# Altium schematic sheet MySTM32F103C8.SchDoc: MySTM32F103C8
size A3; DrawnBy: Pami; DocumentNumber: P010; Revision: v1.1; SheetNumber: 1; SheetTotal: 1
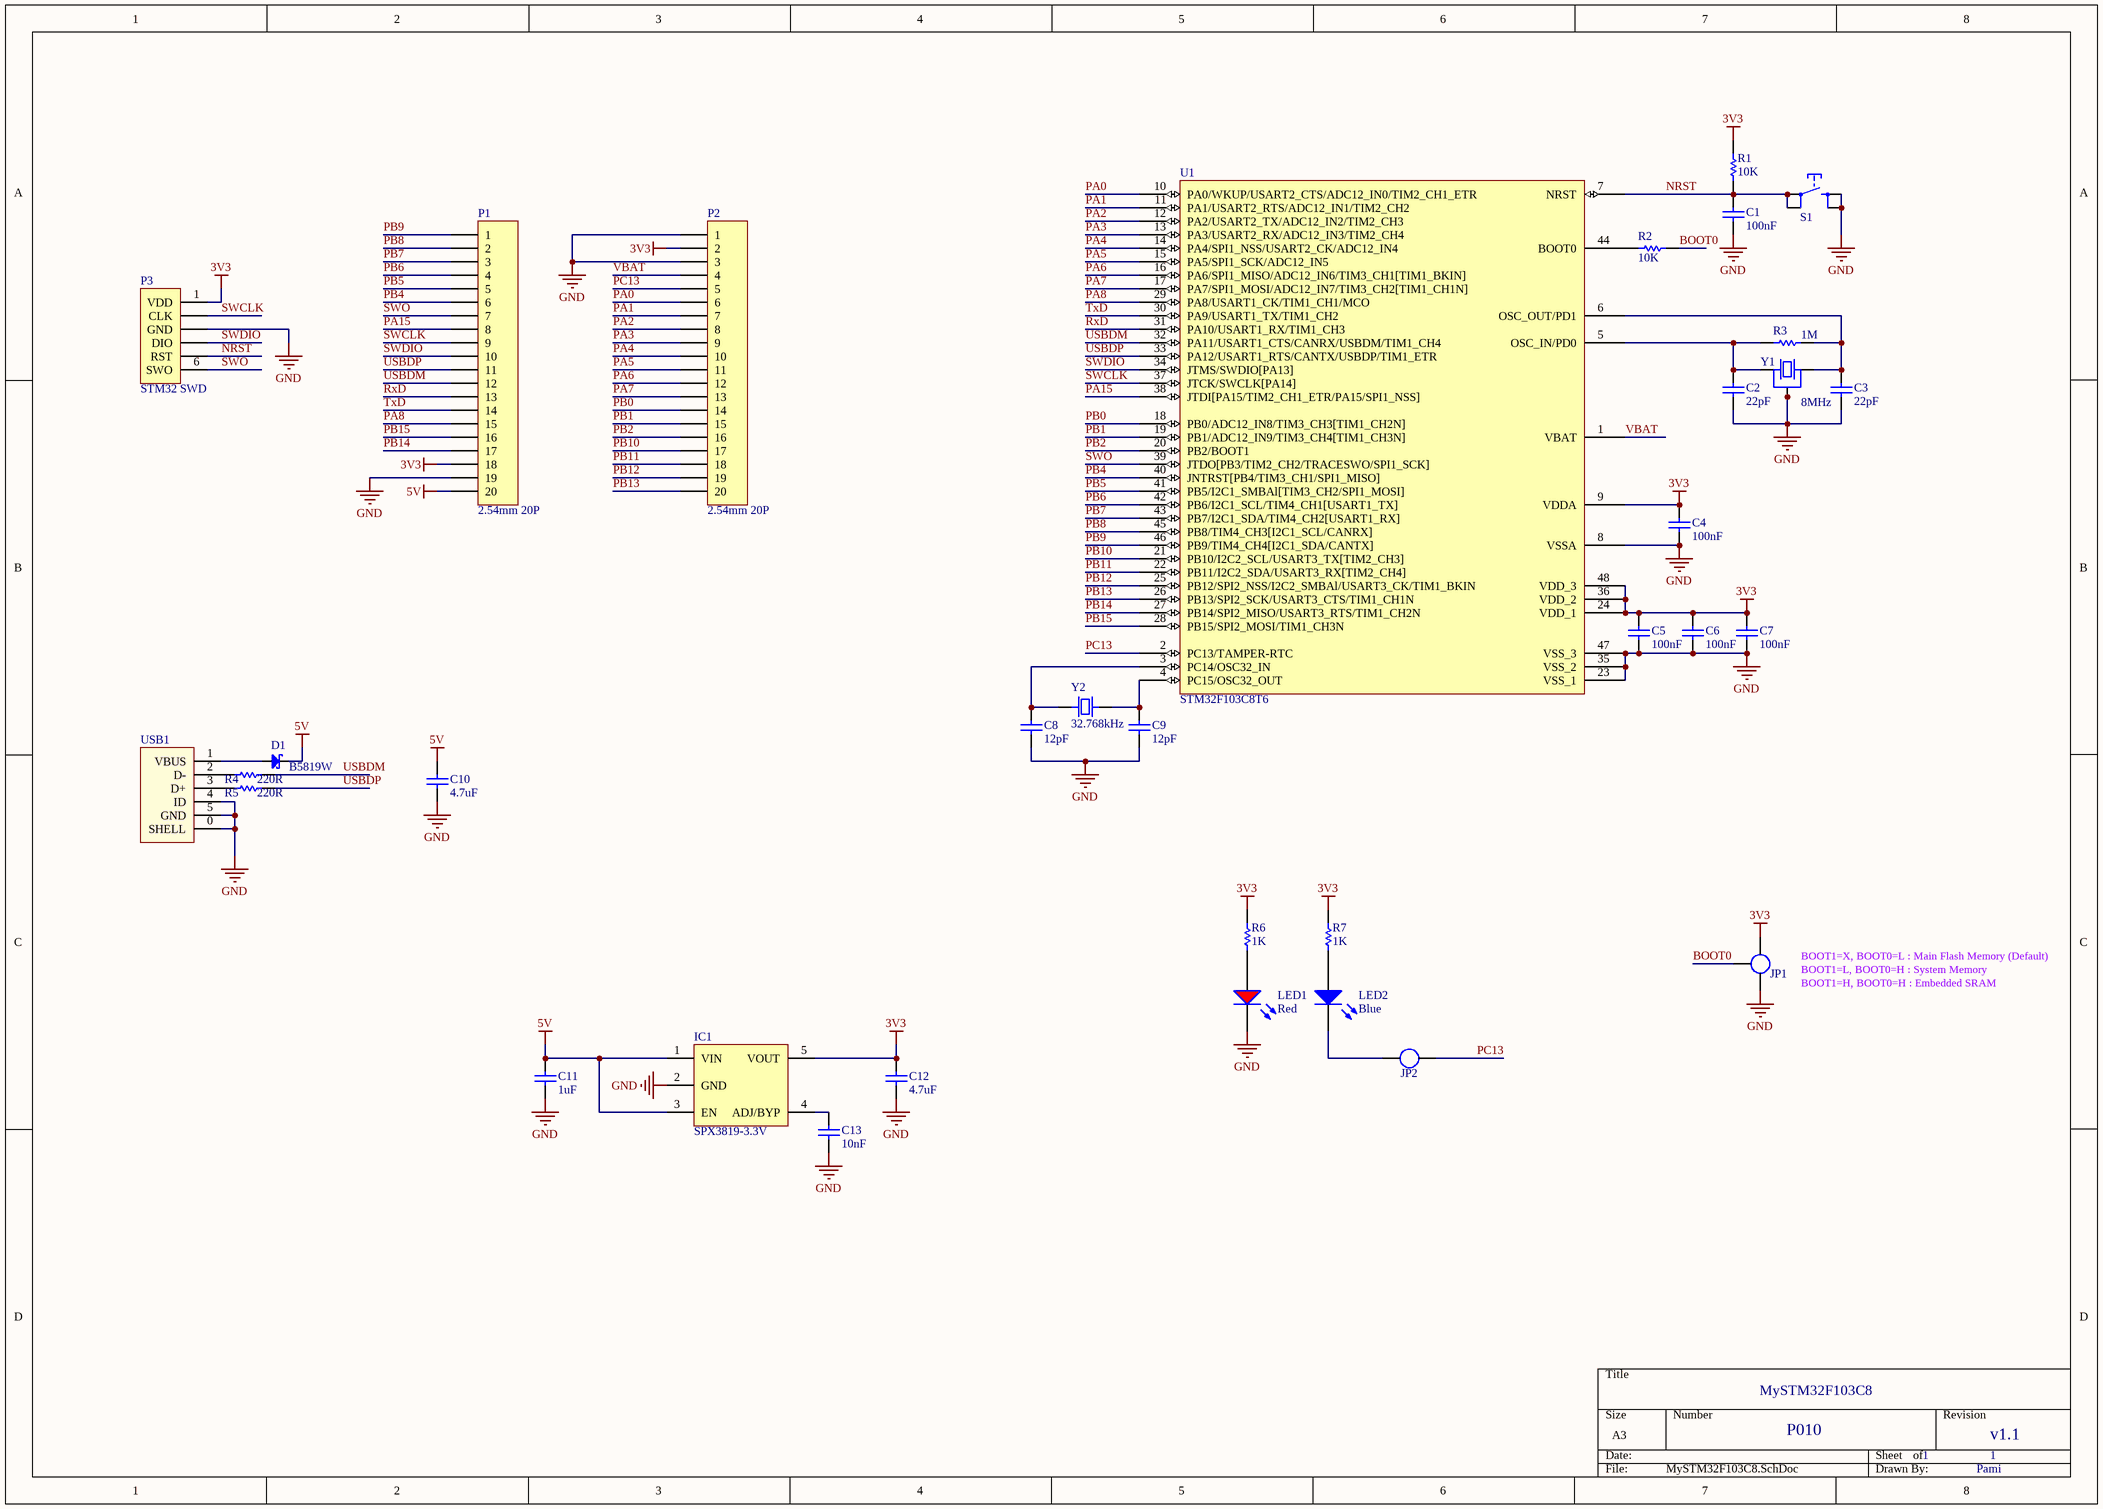
[diagram p0: MySTM32F103C8.SchDoc]

## Parts
C1  100nF  [SMD-CAP-0402]
C2  22pF  [SMD-CAP-0402]
C3  22pF  [SMD-CAP-0402]
C4  100nF  [SMD-CAP-0402]
C5  100nF  [SMD-CAP-0402]
C6  100nF  [SMD-CAP-0402]
C7  100nF  [SMD-CAP-0402]
C8  12pF  [SMD-CAP-0402]
C9  12pF  [SMD-CAP-0402]
C10  4.7uF  [SMD-CAP-0603]
C11  1uF  [SMD-CAP-0402]
C12  4.7uF  [SMD-CAP-0603]
C13  10nF  [SMD-CAP-0402]
D1  B5819W  [SOD-123]
IC1  SPX3819-3.3V  [SOT-23-5]
JP1  JP-3P-P  [SMD-JUMPER-3-PASTE]  (value not drawn)
JP2  JP-2P-P  [SMD-JUMPER-2-PASTE]  (value not drawn)
LED1  Red  [SMD-LED-0603-RED]
LED2  Blue  [SMD-LED-0603-BLUE]
P1  2.54mm 20P  [PSH1x20]
P2  2.54mm 20P  [PSH1x20]
P3  STM32 SWD  [STM32-SWD-PTH-6-2.45]
R1  10K  [SMD-RES-0402]
R2  10K  [SMD-RES-0402]
R3  1M  [SMD-RES-0402]
R4  220R  [SMD-RES-0402]
R5  220R  [SMD-RES-0402]
R6  1K  [SMD-RES-0402]
R7  1K  [SMD-RES-0402]
S1  Tact Switch 4x4  [SMD-SW-4x4]  (value not drawn)
U1  STM32F103C8T6  [LQFP48]
USB1  MicroUSB  [MICRO-USB-5P4S]  (value not drawn)
Y1  8MHz  [OSC-3225]
Y2  32.768kHz  [OSC-FC-135]

## Nets
3V3: C4.2 C5.2 C6.2 C7.2 C12.2 IC1.5(VOUT) JP1.1 P1.18 P2.2 P3.1(VDD) R1.2 R6.2 R7.2 U1.9(VDDA) U1.24(VDD_1) U1.36(VDD_2) U1.48(VDD_3)
5V: C10.2 C11.2 D1.1(K) IC1.1(VIN) IC1.3(EN) P1.20
GND: C1.1 C2.1 C3.1 C4.1 C5.1 C6.1 C7.1 C8.1 C9.1 C10.1 C11.1 C12.1 C13.1 IC1.2(GND) JP1.3 LED1.2(K) P1.19 P2.1 P2.3 P3.3(GND) S1.3 S1.4 U1.8(VSSA) U1.23(VSS_1) U1.35(VSS_2) U1.47(VSS_3) USB1.0(SHELL) USB1.4(ID) USB1.5(GND) Y1.2 Y1.4
BOOT0: JP1.2 R2.1
NRST: C1.2 P3.5(RST) R1.1 S1.1 S1.2 U1.7(NRST)
PA0: P2.6 U1.10(PA0/WKUP/USART2_CTS/ADC12_IN0/TIM2_CH1_ETR)
PA1: P2.7 U1.11(PA1/USART2_RTS/ADC12_IN1/TIM2_CH2)
PA2: P2.8 U1.12(PA2/USART2_TX/ADC12_IN2/TIM2_CH3)
PA3: P2.9 U1.13(PA3/USART2_RX/ADC12_IN3/TIM2_CH4)
PA4: P2.10 U1.14(PA4/SPI1_NSS/USART2_CK/ADC12_IN4)
PA5: P2.11 U1.15(PA5/SPI1_SCK/ADC12_IN5)
PA6: P2.12 U1.16(PA6/SPI1_MISO/ADC12_IN6/TIM3_CH1[TIM1_BKIN])
PA7: P2.13 U1.17(PA7/SPI1_MOSI/ADC12_IN7/TIM3_CH2[TIM1_CH1N])
PA8: P1.15 U1.29(PA8/USART1_CK/TIM1_CH1/MCO)
PA15: P1.8 U1.38(JTDI[PA15/TIM2_CH1_ETR/PA15/SPI1_NSS])
PB0: P2.14 U1.18(PB0/ADC12_IN8/TIM3_CH3[TIM1_CH2N])
PB1: P2.15 U1.19(PB1/ADC12_IN9/TIM3_CH4[TIM1_CH3N])
PB2: P2.16 U1.20(PB2/BOOT1)
PB4: P1.6 U1.40(JNTRST[PB4/TIM3_CH1/SPI1_MISO])
PB5: P1.5 U1.41(PB5/I2C1_SMBAl[TIM3_CH2/SPI1_MOSI])
PB6: P1.4 U1.42(PB6/I2C1_SCL/TIM4_CH1[USART1_TX])
PB7: P1.3 U1.43(PB7/I2C1_SDA/TIM4_CH2[USART1_RX])
PB8: P1.2 U1.45(PB8/TIM4_CH3[I2C1_SCL/CANRX])
PB9: P1.1 U1.46(PB9/TIM4_CH4[I2C1_SDA/CANTX])
PB10: P2.17 U1.21(PB10/I2C2_SCL/USART3_TX[TIM2_CH3])
PB11: P2.18 U1.22(PB11/I2C2_SDA/USART3_RX[TIM2_CH4])
PB12: P2.19 U1.25(PB12/SPI2_NSS/I2C2_SMBAl/USART3_CK/TIM1_BKIN)
PB13: P2.20 U1.26(PB13/SPI2_SCK/USART3_CTS/TIM1_CH1N)
PB14: P1.17 U1.27(PB14/SPI2_MISO/USART3_RTS/TIM1_CH2N)
PB15: P1.16 U1.28(PB15/SPI2_MOSI/TIM1_CH3N)
PC13: JP2.2 P2.5 U1.2(PC13/TAMPER-RTC)
RxD: P1.13 U1.31(PA10/USART1_RX/TIM1_CH3)
SWCLK: P1.9 P3.2(CLK) U1.37(JTCK/SWCLK[PA14])
SWDIO: P1.10 P3.4(DIO) U1.34(JTMS/SWDIO[PA13])
SWO: P1.7 P3.6(SWO) U1.39(JTDO[PB3/TIM2_CH2/TRACESWO/SPI1_SCK])
TxD: P1.14 U1.30(PA9/USART1_TX/TIM1_CH2)
USBDM: P1.12 R4.2 U1.32(PA11/USART1_CTS/CANRX/USBDM/TIM1_CH4)
USBDP: P1.11 R5.2 U1.33(PA12/USART1_RTS/CANTX/USBDP/TIM1_ETR)
VBAT: P2.4 U1.1(VBAT)
NetC2_2: C2.2 R3.1 U1.5(OSC_IN/PD0) Y1.1
NetC3_2: C3.2 R3.2 U1.6(OSC_OUT/PD1) Y1.3
NetC8_2: C8.2 U1.3(PC14/OSC32_IN) Y2.1
NetC9_2: C9.2 U1.4(PC15/OSC32_OUT) Y2.2
NetC13_2: C13.2 IC1.4(ADJ/BYP)
NetD1_2: D1.2(A) USB1.1(VBUS)
NetJP2_1: JP2.1 LED2.2(K)
NetLED1_1: LED1.1(A) R6.1
NetLED2_1: LED2.1(A) R7.1
NetR2_2: R2.2 U1.44(BOOT0)
NetR4_1: R4.1 USB1.2(D-)
NetR5_1: R5.1 USB1.3(D+)

## Notes on the sheet
- (near JP1) BOOT1=X, BOOT0=L : Main Flash Memory (Default)
- (near JP1) BOOT1=L, BOOT0=H : System Memory
- (near JP1) BOOT1=H, BOOT0=H : Embedded SRAM

## Library data of the parts
C1 C4-C7 = 0402 100nF (104) 10% 16V X7R: 贴片电容; Manufacturer: FengHua, YAGEO, Samsung, TDK, Murata; Tolerance: ±10%; Temperature Coefficient: X7R; Unit Price (RMB): 0.05; Voltage: 16V; Mounting Type: Surface Mount, MLCC; Datasheets: -; Operating Temperature: -55°C ~ 125°C; Package / Case: 0402 (1005 Metric); Packaging: Cut Tape (CT); Part Number: -; Part Status: Active; Size / Dimension: 0.039" L x 0.020" W (1.00mm x 0.50mm); Applications: General Purpose; Series: -; Height - Seated (Max): 0.022" (0.55mm); Value: 100nF; Image: -; Categories: 贴片电容
C2 C3 = 0402 22pF (220) 5% 50V COG: 贴片电容; Manufacturer: FengHua, YAGEO, Samsung, TDK, Murata; Tolerance: ±5%; Temperature Coefficient: COG; Unit Price (RMB): 0.05; Voltage: 50; Mounting Type: Surface Mount, MLCC; Datasheets: -; Operating Temperature: -55°C ~ 125°C; Package / Case: 0402 (1005 Metric); Packaging: Cut Tape (CT); Part Number: -; Part Status: Active; Size / Dimension: 0.039" L x 0.020" W (1.00mm x 0.50mm); Applications: General Purpose; Series: -; Height - Seated (Max): 0.022" (0.55mm); Value: 22pF; Image: -; Categories: 贴片电容
C8 C9 = 0402 12pF (120) 5% 50V COG: 贴片电容; Manufacturer: FengHua, YAGEO, Samsung, TDK, Murata; Tolerance: ±5%; Temperature Coefficient: COG; Unit Price (RMB): 0.05; Voltage: 50; Mounting Type: Surface Mount, MLCC; Datasheets: -; Operating Temperature: -55°C ~ 125°C; Package / Case: 0402 (1005 Metric); Packaging: Cut Tape (CT); Part Number: -; Part Status: Active; Size / Dimension: 0.039" L x 0.020" W (1.00mm x 0.50mm); Applications: General Purpose; Series: -; Height - Seated (Max): 0.022" (0.55mm); Value: 12pF; Image: -; Categories: 贴片电容
C10 C12 = 0603 4.7uF (475) 10% 10V X5R: 贴片电容; Manufacturer: FengHua, YAGEO, Samsung, TDK, Murata; Tolerance: ±10%; Temperature Coefficient: X5R; Unit Price (RMB): 0.1; Voltage: 10V; Mounting Type: Surface Mount, MLCC; Datasheets: -; Operating Temperature: -55°C ~ 85°C; Package / Case: 0603 (1608 Metric); Packaging: Cut Tape (CT); Part Number: -; Part Status: Active; Size / Dimension: 0.063" L x 0.031" W (1.60mm x 0.80mm); Applications: General Purpose; Series: -; Height - Seated (Max): 0.035" (0.90mm); Value: 4.7uF; Image: -; Categories: 贴片电容
C11 = 0402 1uF(105) 10% 16V X5R: 贴片电容; Manufacturer: FengHua, YAGEO, Samsung, TDK, Murata; Tolerance: ±10%; Temperature Coefficient: X5R; Unit Price (RMB): 0.1; Voltage: 16V; Mounting Type: Surface Mount, MLCC; Datasheets: -; Operating Temperature: -55°C ~ 85°C; Package / Case: 0402 (1005 Metric); Packaging: Cut Tape (CT); Part Number: -; Part Status: Active; Size / Dimension: 0.039" L x 0.020" W (1.00mm x 0.50mm); Applications: General Purpose; Series: -; Height - Seated (Max): 0.022" (0.55mm); Value: 1uF; Image: -; Categories: 贴片电容
C13 = 0402 10nF (103) 10% 50V X7R: 贴片电容; Manufacturer: FengHua, YAGEO, Samsung, TDK, Murata; Tolerance: ±10%; Temperature Coefficient: X7R; Unit Price (RMB): 0.05; Voltage: 50V; Mounting Type: Surface Mount, MLCC; Datasheets: -; Operating Temperature: -55°C ~ 125°C; Package / Case: 0402 (1005 Metric); Packaging: Cut Tape (CT); Part Number: -; Part Status: Active; Size / Dimension: 0.039" L x 0.020" W (1.00mm x 0.50mm); Applications: General Purpose; Series: -; Height - Seated (Max): 0.022" (0.55mm); Value: 10nF; Image: -; Categories: 贴片电容
D1 = B5819W 40V/1A: 贴片二极管; Diode Type: Schottky; Voltage - DC Reverse (Vr) (Max): 40V; Capacitance @ Vr, F: 120pF @ 4V, 1MHz; Current - Reverse Leakage @ Vr: 1mA @ 20V; Current - Average Rectified (Io): 1A; Device Marking: SL; Value: B5819W; Package / Case: SOD-123; Operating Temperature - Junction: -65°C ~ 125°C; Datasheets: http://www.mccsemi.com/up_pdf/B5817W-B5819W(SOD-123).pdf; Categories: 贴片二极管
IC1 = SPX3819M5 3.3V 500mA: 贴片LDO; Manufacturer: EXAR; Part Number: SPX3819M5-L-3-3/TR; Unit Price (RMB): 0.7; Tolerance: 1%; Datasheets: https://www.exar.com/ds/spx3819.pdf; Operating Temperature: -40°C to +125°C; Part Status: Active; Package / Case: SOT-23-5; Image: -; Series: SPX3819; Size / Dimension: 2.9mm*2.8mm*1.45mm; Value: SPX3819-3.3V
LED1 = 0603 Red: 贴片LED
LED2 = 0603 Blue: 贴片LED
P1 P2 = PSH Header 2.54mm 20P: 直插式连接器 2.54mm
P3 = STM32 SWD6 PTH 2.54mm: 调试端口
R1 R2 = 0402 10KΩ (1002) 1% 1/16W: 贴片电阻; Manufacturer: FengHua, YAGEO, RALEC, KOA, ROHM; Power (Watts): 0.0625W, 1/16W; Temperature Coefficient: ±100ppm/°C; Tolerance: ±1%; Unit Price (RMB): 0.01; Datasheets: -; Height - Seated (Max): 0.016" (0.40mm); Image: -; Operating Temperature: -55°C ~ 155°C; Package / Case: 0402 (1005 Metric); Packaging: Cut Tape (CT); Part Status: Active; Series: -; Size / Dimension: 0.039" L x 0.020" W (1.00mm x 0.50mm); Value: 10K; Categories: 贴片电阻
R3 = 0402 1MΩ (1004) 1% 1/16W: 贴片电阻; Manufacturer: FengHua, YAGEO, RALEC, KOA, ROHM; Power (Watts): 0.0625W, 1/16W; Temperature Coefficient: ±100ppm/°C; Tolerance: ±1%; Unit Price (RMB): 0.01; Datasheets: -; Height - Seated (Max): 0.016" (0.40mm); Image: -; Operating Temperature: -55°C ~ 155°C; Package / Case: 0402 (1005 Metric); Packaging: Cut Tape (CT); Part Status: Active; Series: -; Size / Dimension: 0.039" L x 0.020" W (1.00mm x 0.50mm); Value: 1M; Categories: 贴片电阻
R4 R5 = 0402 220Ω (2200) 1% 1/16W: 贴片电阻; Manufacturer: FengHua, YAGEO, RALEC, KOA, ROHM; Power (Watts): 0.0625W, 1/16W; Temperature Coefficient: ±100ppm/°C; Tolerance: ±1%; Unit Price (RMB): 0.01; Datasheets: -; Height - Seated (Max): 0.016" (0.40mm); Image: -; Operating Temperature: -55°C ~ 155°C; Package / Case: 0402 (1005 Metric); Packaging: Cut Tape (CT); Part Status: Active; Series: -; Size / Dimension: 0.039" L x 0.020" W (1.00mm x 0.50mm); Value: 220R; Categories: 贴片电阻
R6 R7 = 0402 1KΩ (1001) 1% 1/16W: 贴片电阻; Manufacturer: FengHua, YAGEO, RALEC, KOA, ROHM; Power (Watts): 0.0625W, 1/16W; Temperature Coefficient: ±100ppm/°C; Tolerance: ±1%; Unit Price (RMB): 0.01; Datasheets: -; Height - Seated (Max): 0.016" (0.40mm); Image: -; Operating Temperature: -55°C ~ 155°C; Package / Case: 0402 (1005 Metric); Packaging: Cut Tape (CT); Part Status: Active; Series: -; Size / Dimension: 0.039" L x 0.020" W (1.00mm x 0.50mm); Value: 1K; Categories: 贴片电阻
S1 = Tact Switch 4x4: 轻触开关
U1 = STM32F103C8T6: 贴片 STM32 MCU
USB1 = MicroUSB 5P 无卷边: 贴片USB母座; Part Number: 614105150721; Interface Type: Micro USB 2.0 Type B; Rated Current: 1 A; Gender: Female; ComponentLink1Description: Manufacturer; ComponentLink1URL: http://www.we-online.de; ComponentLink2Description: Datasheet; ComponentLink2URL: http://katalog.we-online.de/em/datasheet/614105150721.pdf; Published Date: May 2018; Publisher: Wurth Elektronik; Orientation: Vertical; Operating Temperature: -40 to 85 degC; Mounting Technology: THT; Packaging: Tape and Reel
Y1 = 3225 8MHz ±10ppm 10pF: 贴片无源晶振; Capacitance: 10pF; Frequency: 16MHz; Frequency Stability: ±10ppm; Value: 8MHz; Manufacturer: -; Operating Temperature: -40°C ~ 85°C; Mounting Type: 表面贴装; Package / Case: 4-SMD, No Lead; Size / Dimension: 0.126" L x 0.098" W (3.20mm x 2.50mm); Series: -; Height: 0.031" (0.79mm); Packaging: Cut Tape (CT); Categories: 贴片无源晶振
Y2 = 3215 32.768kHz ±20ppm 12.5pF: 贴片晶振; Manufacturer: EPSON; Frequency Tolerance: ±20ppm; Load Capacitance: 12.5pF; Value: 32.768kHz; Operating Temperature: -40°C ~ 85°C; Mounting Type: Surface Mount; Package / Case: 2-SMD, No Lead; Size / Dimension: 0.126" L x 0.061" W (3.20mm x 1.50mm); Series: CERALOCK® CSTCE; Height: 0.035" (0.90mm); Packaging: Cut Tape (CT); Frequency: 32.768kHz; Frequency Stability: -; Datasheets: https://support.epson.biz/td/api/doc_check.php?dl=brief_FC-135&lang=en; Categories: 贴片晶振